# EAGLE design DiffController (EAGLE 9.6.2)
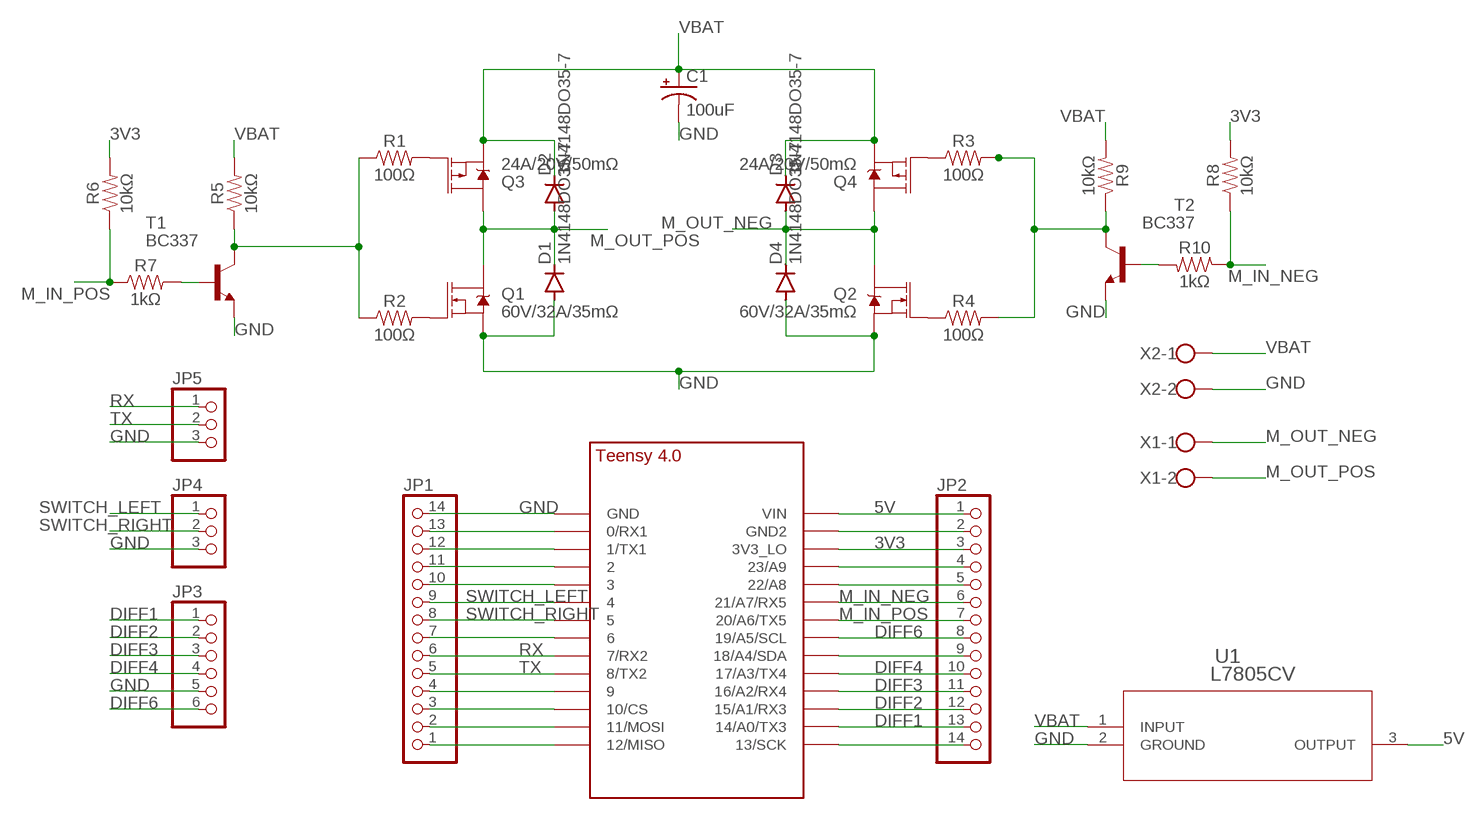
[diagram p0: schematic, sheet 1]

## Parts
C1  100uF  100UF-POLAR-RADIAL-2.5MM-25V-20%  [CPOL-RADIAL-2.5MM-6.5MM]
D1  1N4148DO35-7  [DO35-7]
D2  1N4148DO35-7  [DO35-7]
D3  1N4148DO35-7  [DO35-7]
D4  1N4148DO35-7  [DO35-7]
JP1  PINHD-1X14  [1X14]
JP2  PINHD-1X14  [1X14]
JP3  PINHD-1X6  [1X06]
JP4  PINHD-1X3  [1X03]
JP5  PINHD-1X3  [1X03]
Q1  60V/32A/35mΩ  MOSFET-NCH-FQP30N06L  [TO220V]
Q2  60V/32A/35mΩ  MOSFET-NCH-FQP30N06L  [TO220V]
Q3  24A/20V/50mΩ  MOSFET_PCH-NDP6020P  [TO220V]
Q4  24A/20V/50mΩ  MOSFET_PCH-NDP6020P  [TO220V]
R1  100Ω  RESISTORAXIAL-0.3  [AXIAL-0.3]
R2  100Ω  RESISTORAXIAL-0.3  [AXIAL-0.3]
R3  100Ω  RESISTORAXIAL-0.3  [AXIAL-0.3]
R4  100Ω  RESISTORAXIAL-0.3  [AXIAL-0.3]
R5  10kΩ  RESISTORAXIAL-0.3  [AXIAL-0.3]
R6  10kΩ  RESISTORAXIAL-0.3  [AXIAL-0.3]
R7  1kΩ  RESISTORAXIAL-0.3  [AXIAL-0.3]
R8  10kΩ  RESISTORAXIAL-0.3  [AXIAL-0.3]
R9  10kΩ  RESISTORAXIAL-0.3  [AXIAL-0.3]
R10  1kΩ  RESISTORAXIAL-0.3  [AXIAL-0.3]
T1  BC337  [TO92]
T2  BC337  [TO92]
U1  L7805CV  [TO-220_STM]
U$1  TEENSY_4.0_SIMPLE  [TEENSY_4.0_SIMPLE]
X1  W237-102  [W237-102]
X2  W237-102  [W237-102]

## Nets
3V3: JP2.3 R6.P$2 R8.P$2 U$1.3V3_LO
5V: JP2.1 U1.3(OUTPUT) U$1.VIN
DIFF1: JP2.13 JP3.1 U$1.14/A0(14/A0/TX3)
DIFF2: JP2.12 JP3.2 U$1.15/A1(15/A1/RX3)
DIFF3: JP2.11 JP3.3 U$1.16/A2(16/A2/RX4)
DIFF4: JP2.10 JP3.4 U$1.17/A3(17/A3/TX4)
DIFF6: JP2.8 JP3.6 U$1.19/A5/SCL
GND: C1.2(-) D1.A D4.A JP1.14 JP3.5 JP4.3 JP5.3 Q1.3(S) Q2.3(S) T1.1(E) T2.1(E) U1.2(GROUND) U$1.GND X2.2
M_IN_NEG: JP2.6 R8.P$1 R10.P$1 U$1.21/A7(21/A7/RX5)
M_IN_POS: JP2.7 R6.P$1 R7.P$1 U$1.20/A6(20/A6/TX5)
M_OUT_NEG: D3.A D4.C Q2.2(D) Q4.2(D) X1.1
M_OUT_POS: D1.C D2.A Q1.2(D) Q3.2(D) X1.2
N$1: JP2.9 U$1.18/A4/SDA
N$2: JP2.4 U$1.23/A9
N$3: JP1.13 U$1.0/RX(0/RX1)
N$4: JP1.12 U$1.1/TX(1/TX1)
N$5: JP2.2 U$1.GND2
N$6: JP1.4 U$1.9/CS
N$7: JP1.3 U$1.10/CS
N$8: JP1.2 U$1.11/MOSI
N$9: JP1.1 U$1.12/MISO
N$10: JP2.14 U$1.13/SCK
N$11: JP1.7 U$1.6
N$12: JP2.5 U$1.22/A8
N$13: Q1.1(G) R2.P$2
N$14: Q2.1(G) R4.P$1
N$15: Q3.1(G) R1.P$2
N$16: Q4.1(G) R3.P$1
N$17: R3.P$2 R4.P$2 R9.P$1 T2.3(C)
N$18: R7.P$2 T1.2(B)
N$19: R1.P$1 R2.P$1 R5.P$1 T1.3(C)
N$20: R10.P$2 T2.2(B)
N$21: JP1.11 U$1.2
N$22: JP1.10 U$1.3/CANTX
RX: JP1.6 JP5.1 U$1.7(7/RX2)
SWITCH_LEFT: JP1.9 JP4.1 U$1.4/CANRX
SWITCH_RIGHT: JP1.8 JP4.2 U$1.5
TX: JP1.5 JP5.2 U$1.8(8/TX2)
VBAT: C1.1(+) D2.C D3.C Q3.3(S) Q4.3(S) R5.P$2 R9.P$2 U1.1(INPUT) X2.1

## Library data of the parts
C1 = SparkFun-Capacitors:100UF-POLAR: 100µF polarized capacitors A capacitor is a passive two-terminal electrical component used to store electrical energy temporarily in an electric field.; PROD_ID: CAP-08439
D1-D4 = diode:1N4148: DIODE high speed (Philips)
JP1 JP2 = Connectors:PINHD-1X14: PIN HEADER
JP3 = GTOR - Connectors:PINHD-1X6: PIN HEADER
JP4 JP5 = GTOR - Connectors:PINHD-1X3: PIN HEADER
Q1 Q2 = SparkFun-DiscreteSemi:MOSFET-NCH: N-channel MOSFETs Voltage controlled devices that allow control of high current outputs. SparkFun Products: SparkFun OpenScale <https://www.sparkfun.com/products/13261> SparkFun Digital Sandbox <https://www.sparkfun.com/products/12651> SparkFun Monster Moto Shield <https://www.sparkfun.com/products/10182> SparkFun MOSFET Power Controller <https://www.sparkfun.com/products/11214>; PROD_ID: TRANS-10060
Q3 Q4 = SparkFun-DiscreteSemi:MOSFET_PCH: P-channel MOSFETs Voltage controlled devices that allow control of high current outputs. SparkFun Products: SparkFun ESP32 Thing <https://www.sparkfun.com/products/13907> SparkFun ESP8266 Thing <https://www.sparkfun.com/products/13231>; PROD_ID: TRANS-13060
R1-R10 = SparkFun-Resistors:RESISTOR: Generic Resistor Package
T1 T2 = transistor:BC337: NPN TRANSISTOR
U1 = L7805CV:L7805CV; BUILT_BY: EMA_UL_Team; MANUFACTURER_PART_NUMBER: L7805CV; SOURCELIBRARY: Updates_to_database_2020-11-10; VENDOR: STMicroelectronics
U$1 = GTOR - Microcontroller:TEENSY_4.0_SIMPLE
X1 X2 = con-wago-500:W237-102: WAGO SCREW CLAMP; MPN: 237-102; OC_FARNELL: unknown; OC_NEWARK: 70K9898

## Board
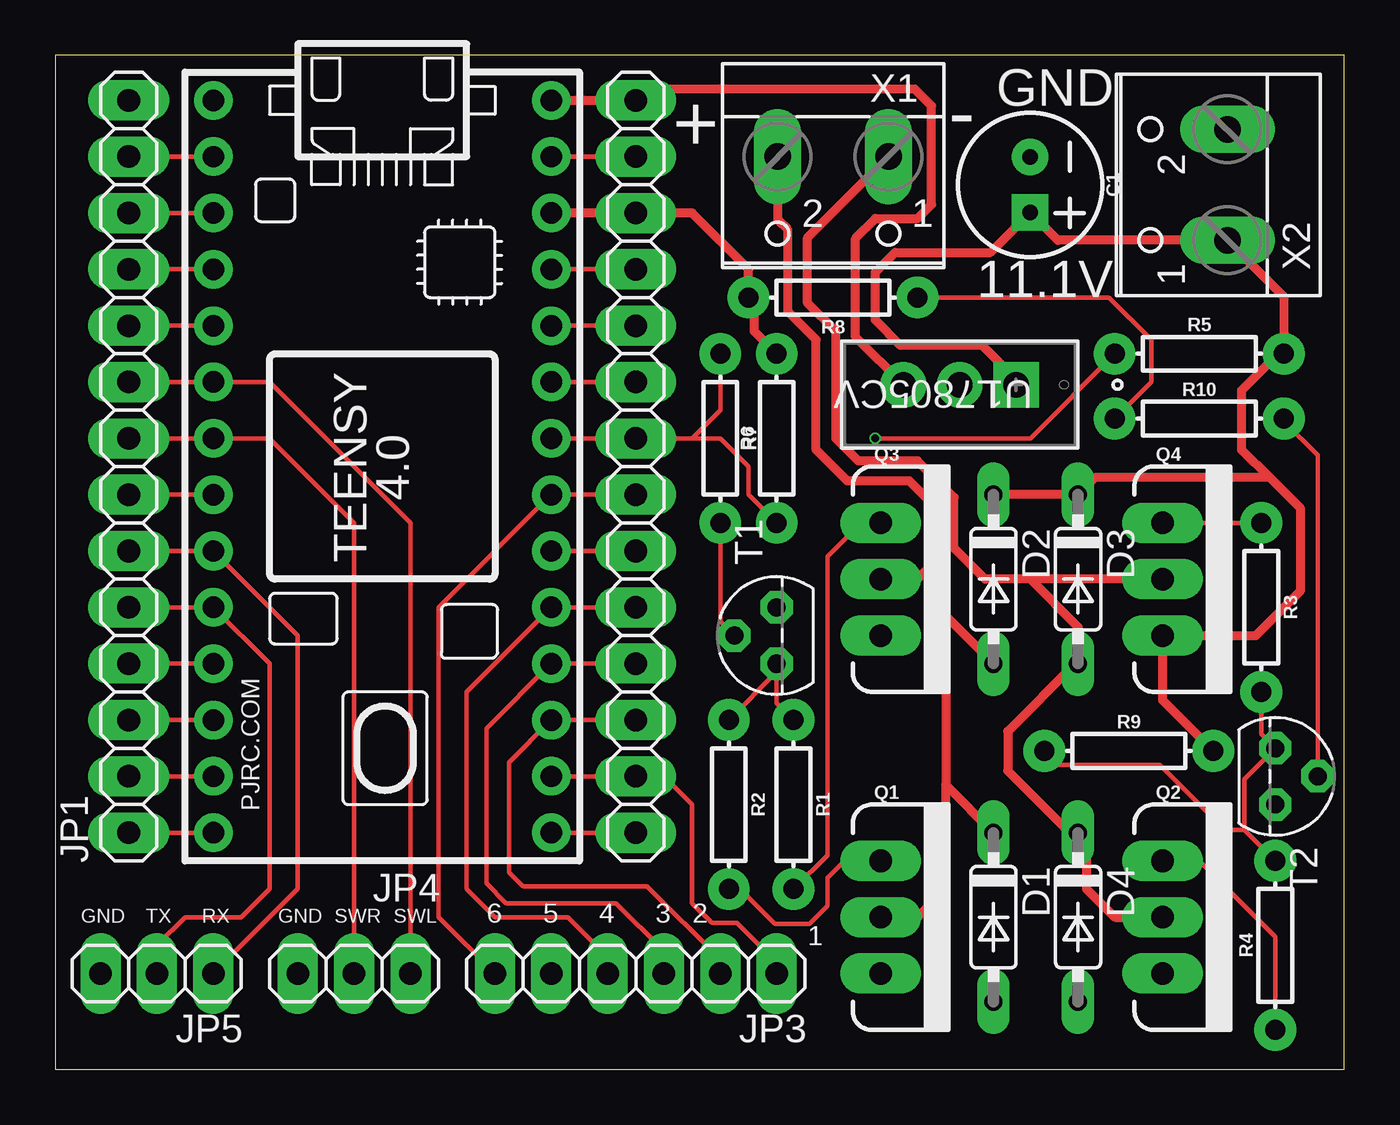
[diagram p1: board, top side]
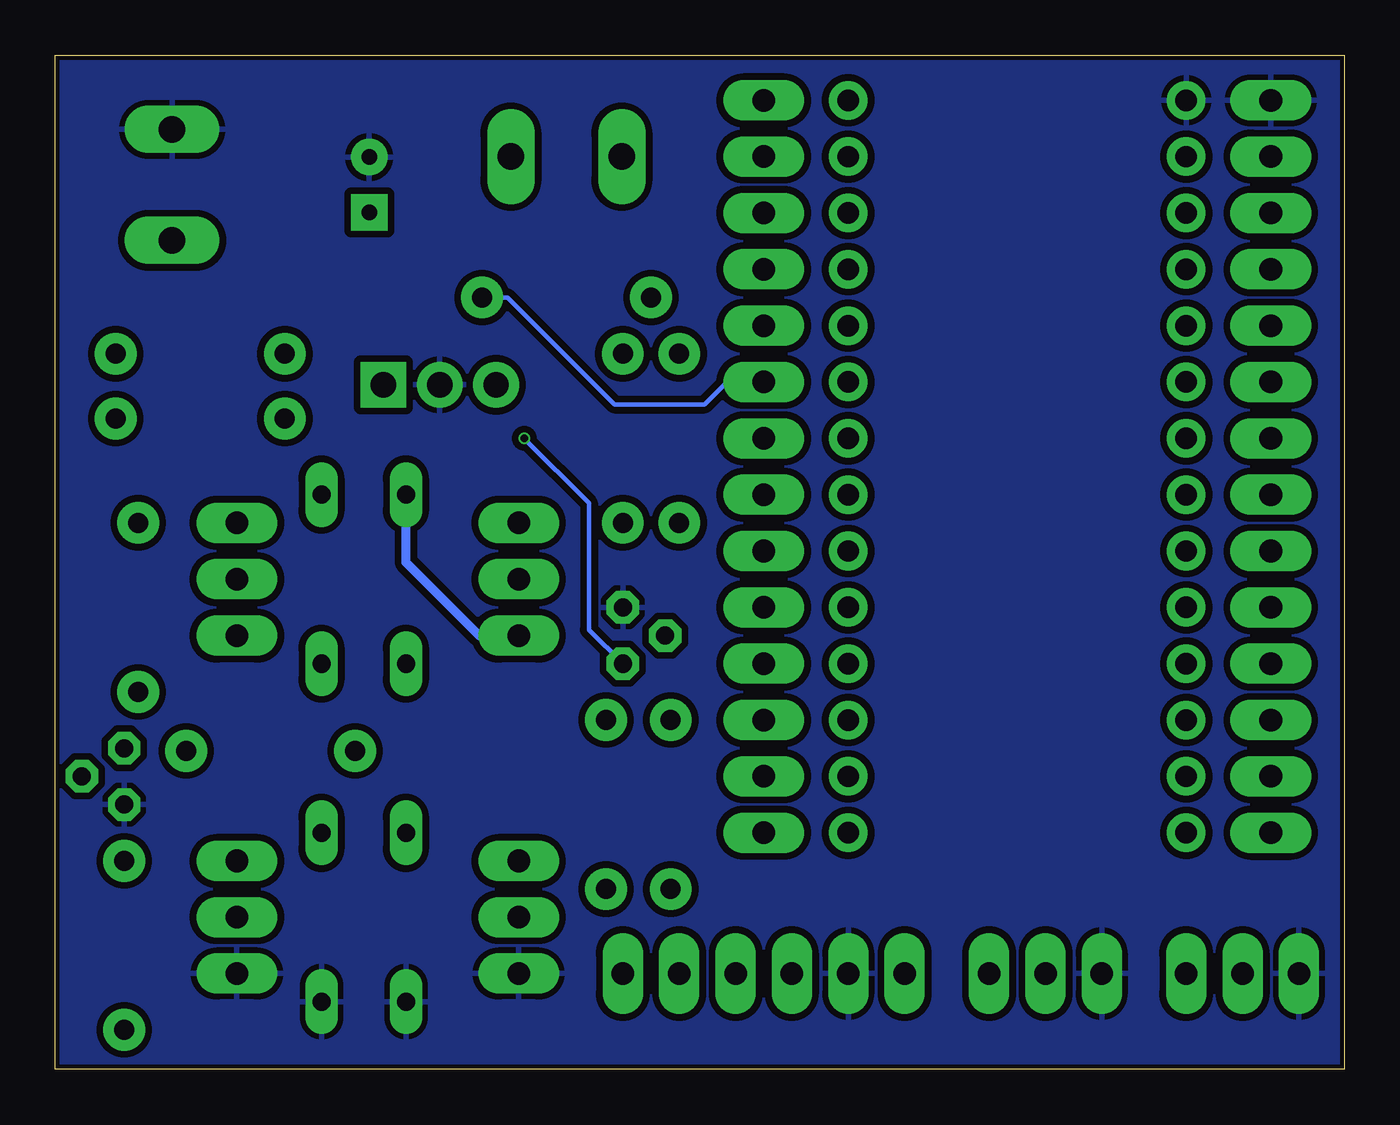
[diagram p2: board, bottom side, seen from below]

Size 58.09 x 45.71 mm. Coordinates in mm from the lower left corner, seen from the top.
Outline: 0,0 58.09,0 58.09,45.71 0,45.71 0,0
Copper layers (1*16): Top 0.035mm / dielectric 1.6mm / Bottom 0.035mm
Design rules "jlcpcb-2layers *": minimum track width 8mil, minimum drill 0.3mm, track to track 12mil, track to pad 12mil, pad to pad 12mil, via to via 12mil, smd to smd 5mil, copper to edge 0.2mm, drill to drill 6mil, minimum pad ring 10mil, minimum via ring 3mil, stop-mask expansion 4mil, vias tented up to drill 0mil, thermal gap 10mil

### Footprints (pad centres in the part's own frame; a part is rotated, then mirrored left to right if it is on the bottom)
CPOL-RADIAL-2.5MM-6.5MM = drill 0.7 pad 1.651 square: 1 1.25,0 | drill 0.7 pad 1.651: 2 -1.25,0
DO35-7 = drill 0.813 long: A 3.81,0; C -3.81,0
1X14 = drill 1.016 long: 1 -16.51,0; 2 -13.97,0; 3 -11.43,0; 4 -8.89,0; 5 -6.35,0; 6 -3.81,0; 7 -1.27,0; 8 1.27,0; 9 3.81,0; 10 6.35,0; 11 8.89,0; 12 11.43,0; 13 13.97,0; 14 16.51,0
1X06 = drill 1.016 long: 1 -6.35,0; 2 -3.81,0; 3 -1.27,0; 4 1.27,0; 5 3.81,0; 6 6.35,0
1X03 = drill 1.016 long: 1 -2.54,0; 2 0,0; 3 2.54,0
TO220V = drill 1.016 long: 1 -2.54,0; 2 0,0; 3 2.54,0
AXIAL-0.3 = drill 0.9 pad 1.88: P$1 -3.81,0; P$2 3.81,0
TO92 = drill 0.813 octagon: 1 1.27,0; 2 0,1.905; 3 -1.27,0
TO-220_STM = drill 1.143 pad 1.651 square: 1 0,0 | drill 1.143 pad 1.651: 2 2.54,0; 3 5.08,0
TEENSY_4.0_SIMPLE = drill 0.965: 0/RX -13.97,-7.62; 1/TX -11.43,-7.62; 2 -8.89,-7.62; 3/CANTX -6.35,-7.62; 3V3_LO -11.43,7.62; 4/CANRX -3.81,-7.62; 5 -1.27,-7.62; 6 1.27,-7.62; 7 3.81,-7.62; 8 6.35,-7.62; 9/CS 8.89,-7.62; 10/CS 11.43,-7.62; 11/MOSI 13.97,-7.62; 12/MISO 16.51,-7.62; 13/SCK 16.51,7.62; 14/A0 13.97,7.62; 15/A1 11.43,7.62; 16/A2 8.89,7.62; 17/A3 6.35,7.62; 18/A4/SDA 3.81,7.62; 19/A5/SCL 1.27,7.62; 20/A6 -1.27,7.62; 21/A7 -3.81,7.62; 22/A8 -6.35,7.62; 23/A9 -8.89,7.62; GND -16.51,-7.62; GND2 -13.97,7.62; VIN -16.51,7.62
W237-102 = drill 1.194 long: 1 -2.5,-1.27; 2 2.5,-1.27

### Placement (x,y rotation side)
C1  43.94,39.88 270 top
D1  42.29,6.86 270 top
D2  42.29,22.1 270 top
D3  46.1,22.1 270 top
D4  46.1,6.86 270 top
JP1  3.3,27.18 90 top
JP2  26.16,27.18 270 top
JP3  26.16,4.32 180 top
JP4  13.46,4.32 180 top
JP5  4.57,4.32 180 top
Q1  37.21,6.86 270 top
Q2  49.91,6.86 270 top
Q3  37.21,22.1 270 top
Q4  49.91,22.1 270 top
R1  33.27,11.94 270 top
R2  30.35,11.94 270 top
R3  54.36,20.83 270 top
R4  54.99,5.59 90 top
R5  51.56,32.26 0 top
R6  32.51,28.45 90 top
R7  29.97,28.45 270 top
R8  35.05,34.8 180 top
R9  48.39,14.35 0 top
R10  51.56,29.34 0 top
T1  32.51,19.56 90 top
T2  54.99,13.21 270 top
U1  43.31,30.86 180 top
U$1  14.73,27.18 270 top
X1  35.05,39.88 180 top
X2  51.56,39.88 90 top

### Tracks (layer width: path | path; a pad name or v marks a point on that pad's centre or on a via)
3V3
  Top 0.406: U$1.3V3_LO JP2.3 28.7,38.61 31.24,36.07 R8.P$2 31.5,34.54 31.5,33.27 R6.P$2
5V
  Top 0.406: U$1.VIN JP2.1 26.67,44.2 38.73,44.2 39.5,43.43 39.5,38.99 38.86,38.35 36.96,38.35 36.07,37.46 36.07,33.02 U1.3
DIFF1
  Top 0.203: JP3.1 32.51,4.83 30.73,6.6 29.59,6.6 28.7,7.49 28.7,11.94 27.43,13.21 JP2.13 U$1.14/A0
DIFF2
  Top 0.203: JP3.2 29.97,4.95 26.67,8.26 21.08,8.26 20.45,8.89 20.45,13.84 U$1.15/A1 JP2.12
DIFF3
  Top 0.203: JP3.3 27.43,5.33 25.27,7.49 20.32,7.49 19.43,8.38 19.43,15.37 U$1.16/A2 JP2.11
DIFF4
  Top 0.203: JP3.4 24.89,5.08 23.11,6.86 19.81,6.86 18.54,8.13 18.54,17.02 U$1.17/A3 JP2.10
DIFF6
  Top 0.203: JP3.6 17.27,6.86 17.27,20.83 U$1.19/A5/SCL JP2.8
GND
  pour Bottom: 0,45.72 58.42,45.72 58.42,0 0,0
M_IN_NEG
  Top 0.203: JP2.6 U$1.21/A7 | R10.P$1 49.4,30.99 49.4,32.89 47.5,34.8 R8.P$1
  Bottom 0.203: R8.P$1 37.72,34.8 32.89,29.97 28.83,29.97 27.81,30.99 JP2.6
M_IN_POS
  Top 0.203: R6.P$1 31.24,25.91 31.24,27.18 29.97,28.45 28.7,28.45 | 28.7,28.45 JP2.7 U$1.20/A6 | R7.P$1 29.97,29.72 28.7,28.45
M_OUT_NEG
  Top 0.406: Q2.2 47.75,6.86 46.48,8.13 46.48,10.29 D4.C 45.72,10.67 42.93,13.46 42.93,15.24 45.97,18.29 D3.A 46.1,19.94 43.94,22.1 | Q4.2 43.94,22.1 | 43.94,22.1 41.91,22.1 40.51,23.5 40.51,25.78 38.86,27.43 36.2,27.43 35.18,28.45 35.18,33.27 33.91,34.54 33.91,37.5 X1.1
M_OUT_POS
  Top 0.406: X1.2 32.55,38.31 33.02,37.85 33.02,34.16 34.29,32.89 34.29,27.94 35.69,26.54 38.48,26.54 39.62,25.4 39.62,22.86 | 39.62,22.86 38.86,22.1 Q3.2 | D2.A 40.13,20.45 | 40.13,20.45 39.62,20.96 39.62,22.86 | 40.13,20.45 40.13,12.83 | 40.13,12.83 D1.C | Q1.2 38.86,6.86 40.13,8.13 40.13,12.83
N$1
  Top 0.203: U$1.18/A4/SDA JP2.9
N$2
  Top 0.203: JP2.4 U$1.23/A9
N$3
  Top 0.203: JP1.13 U$1.0/RX
N$4
  Top 0.203: JP1.12 U$1.1/TX
N$5
  Top 0.203: U$1.GND2 JP2.2
N$6
  Top 0.203: JP1.4 U$1.9/CS
N$7
  Top 0.203: JP1.3 U$1.10/CS
N$8
  Top 0.203: JP1.2 U$1.11/MOSI
N$9
  Top 0.203: JP1.1 U$1.12/MISO
N$10
  Top 0.203: JP2.14 U$1.13/SCK
N$11
  Top 0.203: JP1.7 U$1.6
N$12
  Top 0.203: JP2.5 U$1.22/A8
N$13
  Top 0.203: R2.P$2 30.86,8.13 32.44,6.55 33.98,6.55 34.8,7.37 34.8,8.64 35.56,9.4 Q1.1
N$14
  Top 0.203: R4.P$1 54.99,5.97 51.56,9.4 Q2.1
N$15
  Top 0.203: Q3.1 36.32,24.64 34.8,23.11 34.8,9.65 R1.P$2
N$16
  Top 0.203: Q4.1 R3.P$1
N$17
  Top 0.203: R3.P$2 54.36,15.11 T2.3 53.59,13.08 53.59,10.79 | R4.P$2 53.59,10.79 | R9.P$1 45.21,13.72 49.78,13.72 52.7,10.79 53.59,10.79
N$18
  Top 0.203: T1.2 29.97,20.19 R7.P$2
N$19  (via drill 0.35)
  Top 0.203: R2.P$1 32.51,17.91 T1.3 32.51,16.51 R1.P$1 | R5.P$1 43.94,28.45 v36.96,28.45
  Bottom 0.203: v36.96,28.45 34.04,25.53 34.04,19.81 T1.3
N$20
  Top 0.203: T2.2 56.9,27.69 55.37,29.21 R10.P$2
N$21
  Top 0.203: JP1.11 U$1.2
N$22
  Top 0.203: JP1.10 U$1.3/CANTX
RX
  Top 0.203: JP5.1 10.92,8.13 10.92,19.56 U$1.7 JP1.6
SWITCH_LEFT
  Top 0.203: JP4.1 16,24.64 9.65,30.99 U$1.4/CANRX JP1.9
SWITCH_RIGHT
  Top 0.203: JP4.2 13.46,24.64 9.65,28.45 U$1.5 JP1.8
TX
  Top 0.203: JP5.2 4.57,5.59 5.84,6.86 8.38,6.86 9.65,8.13 9.65,18.29 U$1.8 JP1.5
VBAT
  Top 0.406: U1.1 43.31,31.11 41.78,32.64 38.1,32.64 36.96,33.78 36.96,35.94 37.85,36.83 42.14,36.83 C1.1 45.19,37.38 X2.1 55.37,34.84 R5.P$2 55.12,32.26 53.47,30.61 53.47,27.94 54.74,26.67 | D2.C D3.C 46.86,26.67 54.74,26.67 | R9.P$2 49.91,16.64 Q4.3 54.1,19.56 56.13,21.59 56.13,25.27 54.74,26.67
  Bottom 0.406: Q3.3 38.99,19.56 42.29,22.86 D2.C

### Text on the board
tPlace: GND | TX | RX | GND | SWR | SWL | 6 | 5 | 4 | 3 | 2 | 1
tNames: GND | + | - | 11.1V